# Altium schematic sheet TopSheetIGuess.SchDoc
size A
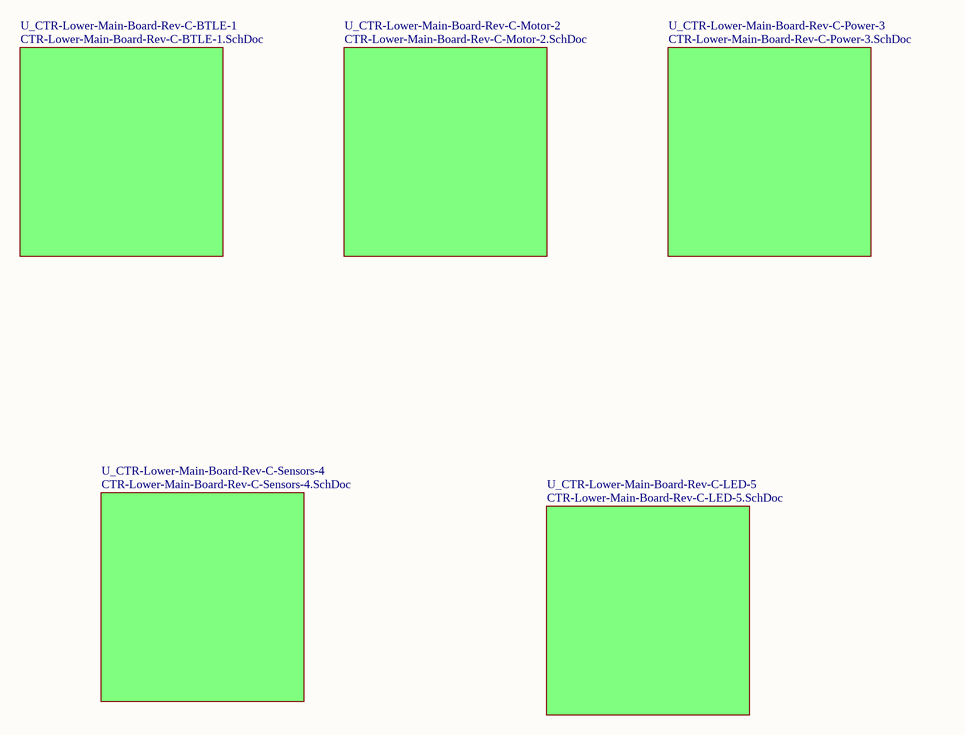
[diagram p0: TopSheetIGuess.SchDoc]

## Sub-sheets
U_CTR-Lower-Main-Board-Rev-C-BTLE-1 = CTR-Lower-Main-Board-Rev-C-BTLE-1.SchDoc: no entries
U_CTR-Lower-Main-Board-Rev-C-LED-5 = CTR-Lower-Main-Board-Rev-C-LED-5.SchDoc: no entries
U_CTR-Lower-Main-Board-Rev-C-Motor-2 = CTR-Lower-Main-Board-Rev-C-Motor-2.SchDoc: no entries
U_CTR-Lower-Main-Board-Rev-C-Power-3 = CTR-Lower-Main-Board-Rev-C-Power-3.SchDoc: no entries
U_CTR-Lower-Main-Board-Rev-C-Sensors-4 = CTR-Lower-Main-Board-Rev-C-Sensors-4.SchDoc: no entries